# Altium schematic sheet Diagram_Power.SchDoc
size A
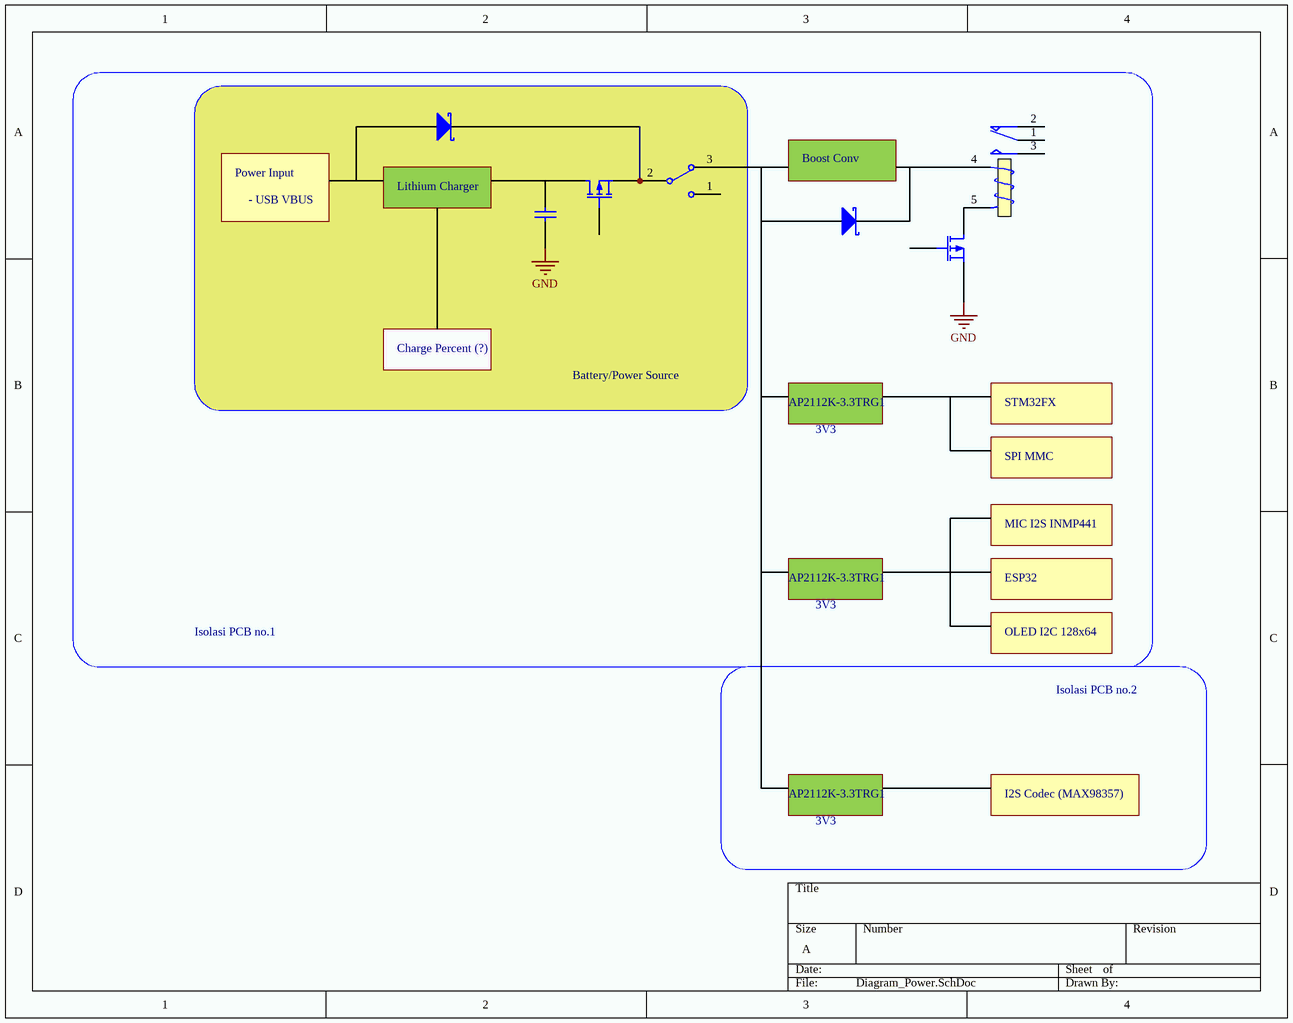
[diagram p0: Diagram_Power.SchDoc]

## Parts
1  (no value)
2  (no value)
3  (no value)
4  (no value)
5  (no value)
7  (no value)
?  (no value)

## Nets
Net1_5: 1.5(T2) 5.1(D)
Net2_3: 2.3(S) 7.2

Not connected (* = marked no-connect by the designer): 1 1(COM) 2(NC) 3(NO) 4(T1); 2 1(D) 2(G); 3 1(A) 2(K); 4 1 2; 5 2(G) 3(S); 7 1 3; ? 1(A) 2(K)

## Notes on the sheet
- Boost Conv
- Power Input
- - USB VBUS
- Lithium Charger
- Charge Percent (?)
- Battery/Power Source
- AP2112K-3.3TRG1
- 3V3
- STM32FX
- SPI MMC
- MIC I2S INMP441
- Isolasi PCB no.1
- OLED I2C 128x64
- ESP32
- Isolasi PCB no.2
- I2S Codec (MAX98357)
- Labels drawn without touching a wire or pin: GND

## Library data of the parts
1 = Relay: Published: 8-Jun-2000; LatestRevisionDate: 17-Jul-2002; LatestRevisionNote: Re-released for DXP Platform.; PackageReference: MODULE5B; Publisher: Altium Limited
2 5 = MOSFET-P: P-Channel MOSFET; Published: 8-Jun-2000; LatestRevisionDate: 17-Jul-2002; LatestRevisionNote: Re-released for DXP Platform.; PackageVersion: 1995/1996; PackageReference: E3; Publisher: Altium Limited; PackageDescription: TO, Flat Index; 3 In-Line, Axial Leads; Body Dia. 4.6mm; Lead Dia. 0.5 mm (max)
3 ? = D Schottky: Schottky Diode; Published: 8-Jun-2000; LatestRevisionDate: 17-Jul-2002; LatestRevisionNote: Re-released for DXP Platform.; PackageReference: SMB; Publisher: Altium Limited; PackageDescription: DO-214-AA/SMB; 2 C-Bend Leads; Body 5.3 x 3.6 mm, inc. leads (LxW); Code_JEDEC: DO-214-AA
4 = Cap: Capacitor; Published: 8-Jun-2000; LatestRevisionDate: 17-Jul-2002; LatestRevisionNote: Re-released for DXP Platform.; PackageReference: RAD-0.3; Publisher: Altium Limited; PackageDescription: Radial Cap, Thru-Hole; 2 Leads; 0.3 in Pin Spacing
7 = SW-SPDT: SPDT Subminiature Toggle Switch, Right Angle Mounting, Vertical Actuation; Published: 24-Mar-1999; LatestRevisionDate: 17-Dec-2003; LatestRevisionNote: Schematic revised, PCB Footprint replaced.; DatasheetVersion: 05-Dec-2000; PackageReference: TL36WW15050; Publisher: Altium Limited; PackageDescription: Switch; 4 Leads; ComponentLink1Description: Manufacturer Link; ComponentLink1URL: http://www.apem.com